# EAGLE design Dandanator CPC MX4 v1.2 Rwd (EAGLE 8.6.0)
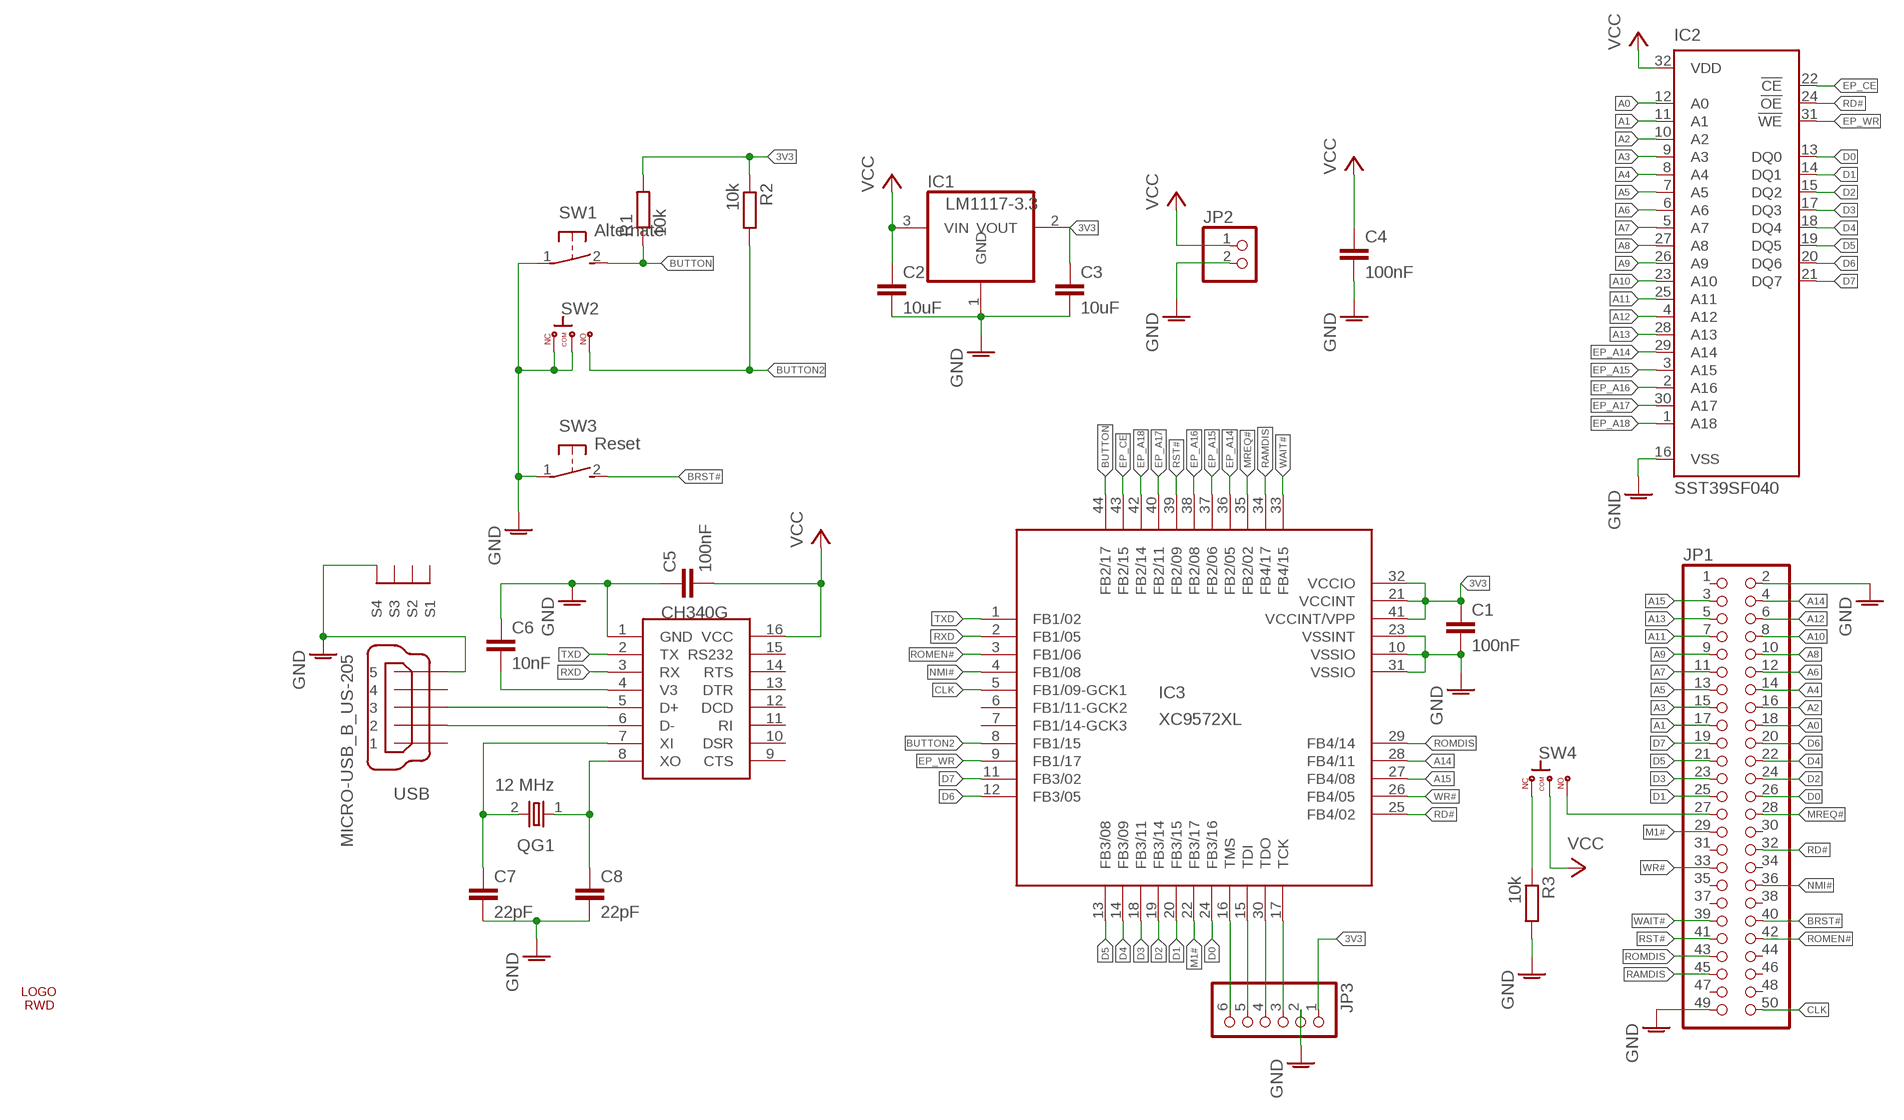
[diagram p0: schematic, sheet 1]

## Parts
C1  100nF  C-EUC0805  [C0805]
C2  10uF  C-EUC0805  [C0805]
C3  10uF  C-EUC0805  [C0805]
C4  100nF  C-EUC0805  [C0805]
C5  100nF  C-EUC0805  [C0805]
C6  10nF  C-EUC0805  [C0805]
C7  22pF  C-EUC0805  [C0805]
C8  22pF  C-EUC0805  [C0805]
CH340G  CH340G  [SOIC16]
IC1  LM1117-3.3  REG1117  [SOT223]
IC2  SST39SF040  MICROCHIP_SST39SF040C  [S32]
IC3  XC9572XL  XC9572XL_44PLCCDIP  [S44]
JP1  PINHD-2X25  [2X25]
JP2  PINHD-1X2  [1X02]
JP3  PINHD-1X6  [1X06]
QG1  12 MHz  CRYSTAL_CRYSTALHC49S  [CRYSTAL_HC49/S]
R1  10k  R-EU_R0805  [R0805]
R2  10k  R-EU_R0805  [R0805]
R3  10k  R-EU_R0805  [R0805]
SW1  Alternate  31-XX  [B3F-31XX]
SW2  Disable  1P2T-MSK12D19  [1P2T-MSK12D19-DIP]
SW3  Reset  31-XX  [B3F-31XX]
SW4  ON/OFF  1P2T-MSK12D19  [1P2T-MSK12D19-DIP]
U$1  LOGO7BOTTOM  [LOGO7_SK22]
USB  MICRO-USB_B_US-205  [MICRO-USB_B_US-205_DIP]

## Nets
3V3: C1.1 C3.1 IC1.2(VOUT) IC3.21(VCCINT) IC3.32(VCCIO) IC3.41(VCCINT/VPP) JP3.1 R1.2 R2.1
A0: IC2.12(A0) JP1.18
A1: IC2.11(A1) JP1.17
A2: IC2.10(A2) JP1.16
A3: IC2.9(A3) JP1.15
A4: IC2.8(A4) JP1.14
A5: IC2.7(A5) JP1.13
A6: IC2.6(A6) JP1.12
A7: IC2.5(A7) JP1.11
A8: IC2.27(A8) JP1.10
A9: IC2.26(A9) JP1.9
A10: IC2.23(A10) JP1.8
A11: IC2.25(A11) JP1.7
A12: IC2.4(A12) JP1.6
A13: IC2.28(A13) JP1.5
A14: IC3.28(FB4/11) JP1.4
A15: IC3.27(FB4/08) JP1.3
AGND: C1.2 C2.2 C3.2 C4.2 C5.1 C6.1 C7.2 C8.2 CH340G.1(GND) IC1.1(GND) IC2.16(VSS) IC3.10(VSSIO) IC3.23(VSSINT) IC3.31(VSSIO) JP1.2 JP1.49 JP2.2 JP3.2 R3.2 SW1.1(P) SW2.P$1 SW2.P$2 SW3.1(P) USB.5 USB.M4(S4) ; supply symbol labelled GND
BRST#: JP1.40 SW3.2(S)
BUTTON: IC3.44(FB2/17) R1.1 SW1.2(S)
BUTTON2: IC3.8(FB1/15) R2.2 SW2.P$3
CLK: IC3.5(FB1/09-GCK1) JP1.50
D0: IC2.13(DQ0) IC3.24(FB3/16) JP1.26
D1: IC2.14(DQ1) IC3.20(FB3/15) JP1.25
D2: IC2.15(DQ2) IC3.19(FB3/14) JP1.24
D3: IC2.17(DQ3) IC3.18(FB3/11) JP1.23
D4: IC2.18(DQ4) IC3.14(FB3/09) JP1.22
D5: IC2.19(DQ5) IC3.13(FB3/08) JP1.21
D6: IC2.20(DQ6) IC3.12(FB3/05) JP1.20
D7: IC2.21(DQ7) IC3.11(FB3/02) JP1.19
EP_A14: IC2.29(A14) IC3.36(FB2/05)
EP_A15: IC2.3(A15) IC3.37(FB2/06)
EP_A16: IC2.2(A16) IC3.38(FB2/08)
EP_A17: IC2.30(A17) IC3.40(FB2/11)
EP_A18: IC2.1(A18) IC3.42(FB2/14)
EP_CE: IC2.22(!CE) IC3.43(FB2/15)
EP_WR: IC2.31(!WE) IC3.9(FB1/17)
M1#: IC3.22(FB3/17) JP1.29
MREQ#: IC3.35(FB2/02) JP1.28
N$1: IC3.16(TMS) JP3.6
N$2: IC3.15(TDI) JP3.5
N$3: IC3.30(TDO) JP3.4
N$4: IC3.17(TCK) JP3.3
N$5: JP1.27 SW4.P$3
N$6: C6.2 CH340G.4(V3)
N$7: CH340G.6(D-) USB.2
N$8: CH340G.5(D+) USB.3
N$9: C8.1 CH340G.8(XO) QG1.1
N$10: C7.1 CH340G.7(XI) QG1.2
N$11: R3.1 SW4.P$1
NMI#: IC3.4(FB1/08) JP1.36
RAMDIS: IC3.34(FB4/17) JP1.45
RD#: IC2.24(!OE) IC3.25(FB4/02) JP1.32
ROMDIS: IC3.29(FB4/14) JP1.43
ROMEN#: IC3.3(FB1/06) JP1.42
RST#: IC3.39(FB2/09) JP1.41
RXD: CH340G.3(RX) IC3.2(FB1/05)
TXD: CH340G.2(TX) IC3.1(FB1/02)
VCC: C2.1 C4.1 C5.2 CH340G.16(VCC) IC1.3(VIN) IC2.32(VDD) JP2.1 SW4.P$2
WAIT#: IC3.33(FB4/15) JP1.39
WR#: IC3.26(FB4/05) JP1.33
Unconnected: CH340G.9(CTS) CH340G.10(DSR) CH340G.11(RI) CH340G.12(DCD) CH340G.13(DTR) CH340G.14(RTS) CH340G.15(RS232) IC3.6(FB1/11-GCK2) IC3.7(FB1/14-GCK3) JP1.1 JP1.30 JP1.31 JP1.34 JP1.35 JP1.37 JP1.38 JP1.44 JP1.46 JP1.47 JP1.48 USB.1 USB.4 USB.M1(S1) USB.M2(S2) USB.M3(S3)

## Library data of the parts
C1-C8 = rcl:C-EU: CAPACITOR, European symbol; SPICEPREFIX: C
CH340G = ch340g:CH340G
IC1 = burr-brown:REG1117: 800mA and 1A Low Dropout (LDO) Positive Regulator 1.8V, 2.5V, 2.85V, 3.3V, 5V, and Adj; MPN: REG1117; OC_FARNELL: 1097566; OC_NEWARK: 14P6981
IC2 = Dandanator CPC MX4 v1.2 Rwd:MICROCHIP_SST39SF040: CMOS EPROM 512 K (64 K x 8)
IC3 = Dandanator CPC MX4 v1.2 Rwd:XC9572XL_44PLCC: xc9536_pc44 XC9500 In-System Programmable CPLD Family Auto generated by make-symbol-device-package-bsdl.ulp Rev. 34 Source: xc9536_pc44.bsd
JP1 = pinhead:PINHD-2X25: PIN HEADER
JP2 = pinhead:PINHD-1X2: PIN HEADER
JP3 = pinhead:PINHD-1X6: PIN HEADER
QG1 = Dandanator CPC Rwd:CRYSTAL_CRYSTAL: CRYSTAL; OC_FARNELL: 1667008; OC_NEWARK: unknown
R1-R3 = rcl:R-EU_: RESISTOR, European symbol; SPICEPREFIX: R
SW1 SW3 = switch-omron:31-XX: OMRON SWITCH; MPN: B3F-3100; OC_FARNELL: 959704; OC_NEWARK: 36M3582
SW2 SW4 = Dandanator CPC MX4 v1.2 Rwd:1P2T-MSK12D19
U$1 = USB_Floppy_PCB_rwd:LOGO7
USB = Dandanator CPC MX4 v1.2 Rwd:MICRO-USB_B_US-205: MINI USB-B R/A W/O POST 5 pol. Source: www.cypressindustries.com

## Board
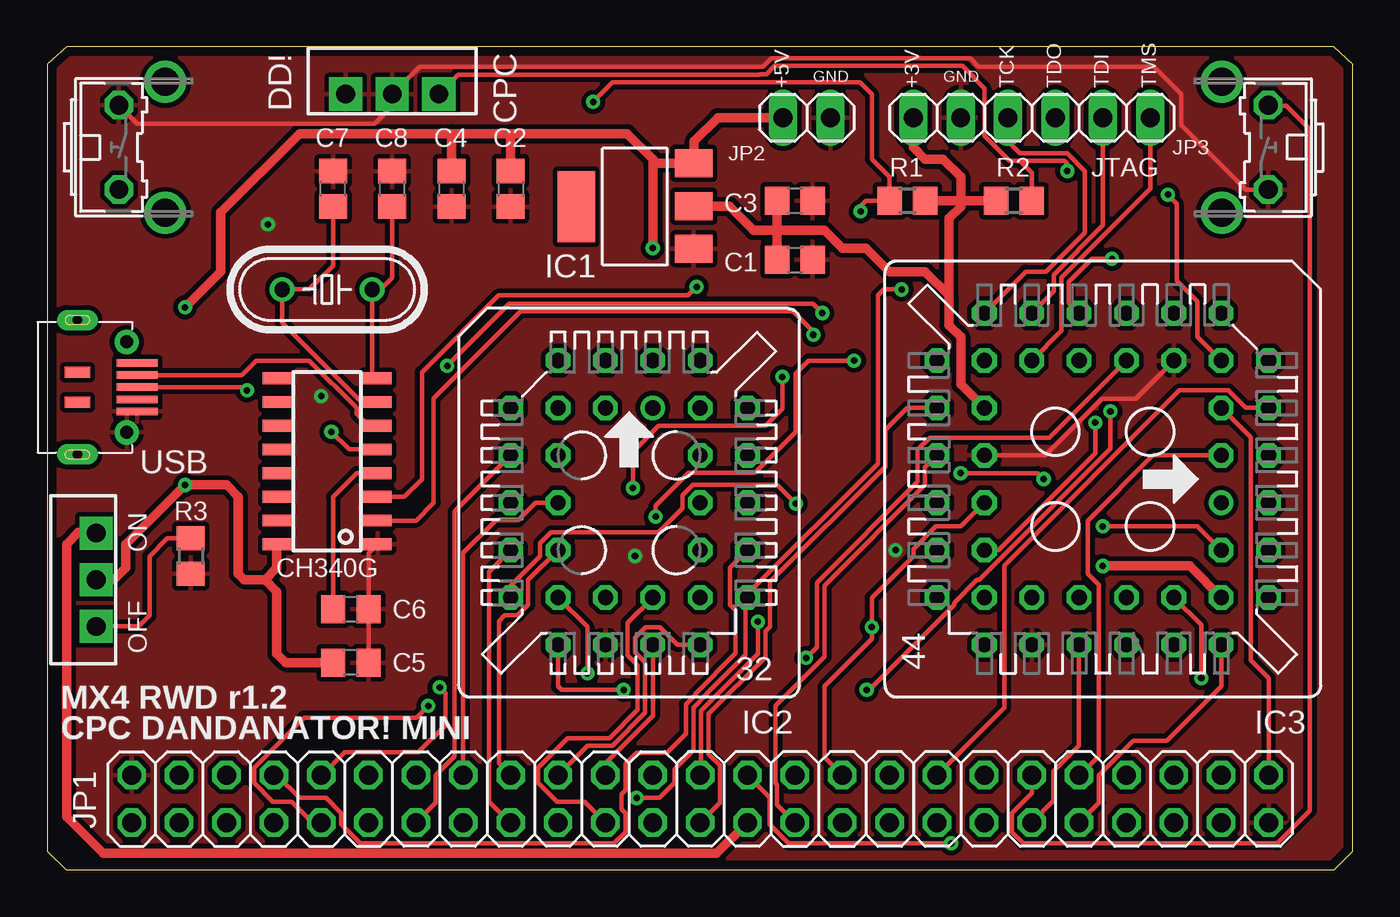
[diagram p1: board, top side]
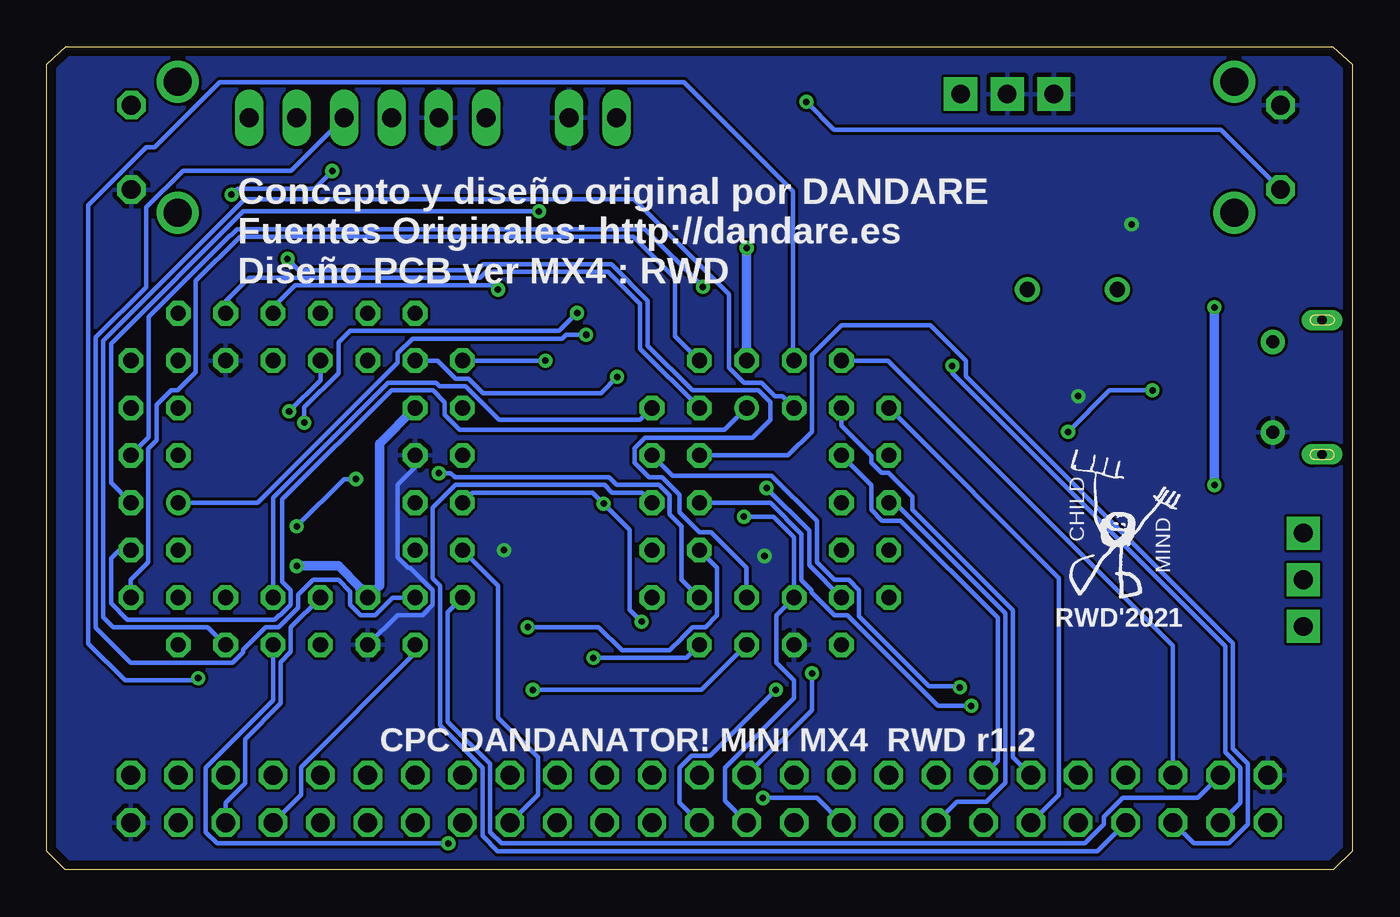
[diagram p2: board, bottom side, seen from below]

Size 70 x 44.13 mm. Coordinates in mm from the lower left corner, seen from the top.
Outline: 68.97,44.13 1.03,44.13 0,43.18 0,1 1,0 69,0 70,1 70,43.18 68.97,44.13
Copper layers (1*16): Top 0.035mm / dielectric 1.5mm / Bottom 0.035mm
Design rules "Rwd *": minimum track width 10mil, minimum drill 0.35mm, track to track 6mil, track to pad 6mil, pad to pad 6mil, via to via 6mil, smd to smd 6mil, copper to edge 0.5mm, drill to drill 8mil, minimum pad ring 10mil, minimum via ring 8mil, stop-mask expansion 4mil, vias tented up to drill 0mil, thermal gap 10mil

### Footprints (pad centres in the part's own frame; a part is rotated, then mirrored left to right if it is on the bottom)
C0805 = smd 1.3 x 1.5: 1 -0.95,0; 2 0.95,0
SOIC16 = smd 0.635 x 1.524: 1 -4.445,-2.695; 2 -3.175,-2.695; 3 -1.905,-2.695; 4 -0.635,-2.695; 5 0.635,-2.695; 6 1.905,-2.695; 7 3.175,-2.695; 8 4.445,-2.695; 9 4.445,2.695; 10 3.175,2.695; 11 1.905,2.695; 12 0.635,2.695; 13 -0.635,2.695; 14 -1.905,2.695; 15 -3.175,2.695; 16 -4.445,2.695
SOT223 = smd 1.499 x 2.007: 1 -2.261,-3.15; 2 0.025,-3.15; 3 2.311,-3.15 | smd 3.81 x 2.007: 4 0,3.15
S32 = drill 0.813: 1 1.27,5.08 | drill 0.813 octagon: 2 -1.27,7.62; 3 -1.27,5.08; 4 -3.81,7.62; 5 -6.35,5.08; 6 -3.81,5.08; 7 -6.35,2.54; 8 -3.81,2.54; 9 -6.35,0; 10 -3.81,0; 11 -6.35,-2.54; 12 -3.81,-2.54; 13 -6.35,-5.08; 14 -3.81,-7.62; 15 -3.81,-5.08; 16 -1.27,-7.62; 17 -1.27,-5.08; 18 1.27,-7.62; 19 1.27,-5.08; 20 3.81,-7.62; 21 6.35,-5.08; 22 3.81,-5.08; 23 6.35,-2.54; 24 3.81,-2.54; 25 6.35,0; 26 3.81,0; 27 6.35,2.54; 28 3.81,2.54; 29 6.35,5.08; 30 3.81,7.62; 31 3.81,5.08; 32 1.27,7.62
S44 = drill 0.813: 1 1.27,6.35 | drill 0.813 octagon: 2 -1.27,8.89; 3 -1.27,6.35; 4 -3.81,8.89; 5 -3.81,6.35; 6 -6.35,8.89; 7 -8.89,6.35; 8 -6.35,6.35; 9 -8.89,3.81; 10 -6.35,3.81; 11 -8.89,1.27; 12 -6.35,1.27; 13 -8.89,-1.27; 14 -6.35,-1.27; 15 -8.89,-3.81; 16 -6.35,-3.81; 17 -8.89,-6.35; 18 -6.35,-8.89; 19 -6.35,-6.35; 20 -3.81,-8.89; 21 -3.81,-6.35; 22 -1.27,-8.89; 23 -1.27,-6.35; 24 1.27,-8.89; 25 1.27,-6.35; 26 3.81,-8.89; 27 3.81,-6.35; 28 6.35,-8.89; 29 8.89,-6.35; 30 6.35,-6.35; 31 8.89,-3.81; 32 6.35,-3.81; 33 8.89,-1.27; 34 6.35,-1.27; 35 8.89,1.27; 36 6.35,1.27; 37 8.89,3.81; 38 6.35,3.81; 39 8.89,6.35; 40 6.35,8.89; 41 6.35,6.35; 42 3.81,8.89; 43 3.81,6.35; 44 1.27,8.89
2X25 = drill 1.016 octagon: 1 -30.48,-1.27; 2 -30.48,1.27; 3 -27.94,-1.27; 4 -27.94,1.27; 5 -25.4,-1.27; 6 -25.4,1.27; 7 -22.86,-1.27; 8 -22.86,1.27; 9 -20.32,-1.27; 10 -20.32,1.27; 11 -17.78,-1.27; 12 -17.78,1.27; 13 -15.24,-1.27; 14 -15.24,1.27; 15 -12.7,-1.27; 16 -12.7,1.27; 17 -10.16,-1.27; 18 -10.16,1.27; 19 -7.62,-1.27; 20 -7.62,1.27; 21 -5.08,-1.27; 22 -5.08,1.27; 23 -2.54,-1.27; 24 -2.54,1.27; 25 0,-1.27; 26 0,1.27; 27 2.54,-1.27; 28 2.54,1.27; 29 5.08,-1.27; 30 5.08,1.27; 31 7.62,-1.27; 32 7.62,1.27; 33 10.16,-1.27; 34 10.16,1.27; 35 12.7,-1.27; 36 12.7,1.27; 37 15.24,-1.27; 38 15.24,1.27; 39 17.78,-1.27; 40 17.78,1.27; 41 20.32,-1.27; 42 20.32,1.27; 43 22.86,-1.27; 44 22.86,1.27; 45 25.4,-1.27; 46 25.4,1.27; 47 27.94,-1.27; 48 27.94,1.27; 49 30.48,-1.27; 50 30.48,1.27
1X02 = drill 1.016 long: 1 -1.27,0; 2 1.27,0
1X06 = drill 1.016 long: 1 -6.35,0; 2 -3.81,0; 3 -1.27,0; 4 1.27,0; 5 3.81,0; 6 6.35,0
CRYSTAL_HC49/S = drill 0.813: 1 -2.413,0; 2 2.413,0
R0805 = smd 1.3 x 1.5: 1 -0.95,0; 2 0.95,0
B3F-31XX = drill 1.016 octagon: 1 -2.261,-1.245; 2 2.261,-1.245 | drill 1.499 pad 2.159: 3 -3.505,1.245; 4 3.505,1.245
1P2T-MSK12D19-DIP = drill 1 pad 1.778 square: P$1 -2.5,0; P$2 0,0; P$3 2.5,0
MICRO-USB_B_US-205_DIP = smd 2.2 x 0.4: 1 4.95,1.3; 2 4.95,0.65; 3 4.95,0; 4 4.95,-0.65; 5 4.95,-1.3 | smd 1.35 x 0.6: 6 1.75,0.8; 7 1.75,-0.8 | drill 0.5 pad 1.1 long: M1 1.75,3.6; M2 1.75,-3.6 | drill 0.7 pad 1.3: M3 4.4,2.425; M4 4.4,-2.425

### Placement (x,y rotation side)
C1  40.08,32.7 0 top
C2  24.84,36.51 270 top
C3  40.08,35.88 0 top
C4  21.66,36.51 270 top
C5  16.27,11.11 180 top
C6  16.27,13.97 180 top
C7  15.32,36.51 90 top
C8  18.49,36.51 90 top
CH340G  15,21.91 90 top
IC1  31.51,35.56 90 top
IC2  31.19,19.68 0 top
IC3  56.59,20.95 270 top
JP1  35,3.81 0 top
JP2  40.72,40.32 0 top
JP3  52.78,40.32 0 top
QG1  15,31.11 180 top
R1  46.11,35.88 0 top
R2  51.83,35.88 0 top
R3  7.7,16.83 270 top
SW1  5.08,38.73 270 top
SW2  18.49,41.59 0 top
SW3  64.21,38.73 90 top
SW4  2.62,15.56 90 top
U$1  8.65,14.29 0 top
USB  -0.14,25.88 0 top

### Tracks (layer width: path | path; a pad name or v marks a point on that pad's centre or on a via)
3V3  (via drill 0.35)
  Top 0.508: C3.1 39.13,34.29 | 39.13,34.29 C1.1 | IC3.21 48.97,26.04 48.97,28.57 48.34,29.21 48.34,30.8 | v56.59,16.29 61.25,16.29 IC3.41 | 39.13,34.29 37.86,34.29 36.56,35.59 IC1.2 | R1.2 48.97,35.88 | 48.97,35.88 48.97,37.15 48.02,38.1 47.06,38.1 46.43,38.73 JP3.1 | 48.34,30.8 48.34,34.92 48.97,35.56 48.97,35.88 | 48.34,30.8 47.06,32.07 45.16,32.07 43.89,33.34 42.62,33.34 41.67,34.29 39.13,34.29 | 48.97,35.88 R2.1
  Bottom 0.508: IC3.21 52.15,22.86 52.15,15.24 IC3.32 53.19,15.01 53.19,15.13 54.35,16.29 v56.59,16.29
A0
  Top 0.254: IC2.12 25.78,15.54 25.78,14.22 25.22,13.65 24.52,13.65 24.21,13.34 24.21,5.71 JP1.18
A1
  Top 0.254: IC2.11 23.67,15.98 23.67,3.66 24.79,2.54 JP1.17
A2
  Top 0.254: IC2.10 26.17,19.68 25.23,18.75 24.05,18.75 22.3,16.99 JP1.16
A3
  Bottom 0.254: IC2.9 24.52,19.68 18.59,13.75 18.59,4.67 19.61,3.66 21.18,3.66 JP1.15
A4
  Bottom 0.254: JP1.14 19,5.84 19,13.53 24.21,18.73 25.22,18.73 25.78,19.3 25.78,20.62 IC2.8
A5
  Top 0.254: IC2.7 21.84,19.23 21.84,6.1 20.83,5.08 20.83,3.61 JP1.13
A6
  Bottom 0.254: IC2.6 27.38,23.81 25.78,22.21 25.78,21.84 25.23,21.29 24.85,21.29 23.57,20 23.57,19.31 18.19,13.92 18.19,6.04 JP1.12
A7
  Bottom 0.254: JP1.11 15.72,4.04 15.72,15.65 IC2.5
A8  (via drill 0.35)
  Top 0.254: JP1.10 14.73,5.08 15.95,6.3 19.89,6.3 21.35,7.76 21.35,9.47 v21.03,9.79
  Bottom 0.254: IC2.27 36.45,21.13 31.12,21.13 28.7,18.71 28.7,16.5 27.75,15.54 26.99,15.54 26.44,14.99 26.44,13.61 22.68,9.84 21.08,9.84 v21.03,9.79
A9  (via drill 0.35)
  Top 0.254: JP1.9 14.22,2.54 13.11,3.66 12.09,3.66 11.07,4.67 11.07,5.49 13.75,8.17 19.79,8.17 v20.42,8.8
  Bottom 0.254: IC2.26 31.2,19.68 29.51,18 29.51,15.53 28.98,14.99 28.98,14.88 27.76,13.65 27.06,13.65 22.21,8.8 v20.42,8.8
A10
  Top 0.254: JP1.8 12.29,5.08 13.51,3.86 14.93,3.86 15.75,3.05 15.75,2.44 16.76,1.42 30.38,1.42 30.99,2.03 30.99,3.05 30.78,3.25 30.78,4.06 30.99,4.27 30.99,5.69 31.58,6.28 33.22,6.28 34.24,7.3 34.24,8.87 34.75,9.38 34.75,9.46 36.91,11.61 36.91,13.91 36.6,14.22 36.6,16.2 IC2.23
A11
  Bottom 0.254: IC2.25 38.09,20.23 39.67,20.23 40.08,20.64 48.08,20.64 49.3,19.41 49.3,15.65 48.89,15.24 48.89,7.75 46.63,5.49 46.63,1.83 45.82,1.02 13.66,1.02 JP1.7
A12
  Bottom 0.254: IC2.4 24.89,27.3 9.6,12.01 JP1.6
A13
  Bottom 0.254: IC2.28 30.24,22.23 28.97,23.5 28.97,27.62 27.38,29.21 22.62,29.21 20.71,27.3 20.71,26.47 6.4,12.16 6.4,6.5 5.59,5.69 5.59,2.44 6.6,1.42 8.48,1.42 JP1.5
A14
  Bottom 0.254: IC3.28 48.49,13.82 48.49,7.95 46.23,5.69 46.23,2.03 45.62,1.42 14.32,1.42 13.31,2.44 13.31,2.85 12.29,3.86 8.28,3.86 JP1.4
A15  (via drill 0.35)
  Top 0.254: v21.44,27.03 24.76,30.35 41.06,30.35 v41.55,29.86 | v56.18,23.98 56.18,22.33 50.99,17.14 IC3.27
  Bottom 0.254: v56.18,23.98 56.18,24.79 54.34,26.64 54.34,28.29 53.73,28.89 42.52,28.89 v41.55,29.86 | v21.44,27.03 21.44,26.62 6.81,11.99 6.81,6.3 5.99,5.49 5.99,3.61 JP1.3
AGND  (via drill 0.35)
  Top 0.254: IC3.10 58.36,25.26 56.54,25.26 53.5,22.23 IC3.23 | SW3.1 64.25,36.47 60.81,39.92 60.81,41.59 59.33,43.07 49.92,43.07 49.48,43.51 38.82,43.51 38.38,43.07 19.96,43.07 SW2.P$2 18.49,40.96 17.54,40.01 4.83,40.01 SW1.1 | C5.1 C6.1 | C6.1 17.22,12.96 | 17.54,17.46 CH340G.1 17.22,16.99 C6.1
  Bottom 0.254: IC3.31 51.18,13.66 49.85,13.66 49.3,14.22 49.3,14.99 50.51,16.2 50.63,16.2 51.19,16.77 51.19,20.64 50.24,21.59 IC3.23
  other vias: 11.82,34.61 14.68,25.4 31.51,16.83 45.48,17.14
  pour Top (isolate 0.254): 0.07,0 69.92,0 69.92,44.13 0.07,44.13
  pour Bottom (isolate 0.025): 0.07,44.13 0.07,0 69.92,0 69.92,44.13
BRST#
  Top 0.254: SW3.2 65.49,40.96 66.43,40.96 67.7,39.69 67.7,3.18 65.94,1.42 52.32,1.42 51.71,2.03 51.71,3.05 52.78,4.12 JP1.40
BUTTON  (via drill 0.35)
  Top 0.254: v29.26,41.17 30.31,42.23 43.57,42.23 44.21,41.59 44.21,38.1 45.16,37.15 R1.1 43.89,35.88 43.6,35.59 v43.6,35.31
  Bottom 0.254: IC3.44 66.55,20.75 66.55,28.21 59.45,35.31 v43.6,35.31 | v29.26,41.17 27.77,39.69 7.05,39.69 SW1.2
BUTTON2  (via drill 0.35)
  Top 0.254: IC3.8 61.67,28.57 61.67,30.48 60.56,31.59 60.56,35.72 v60.08,36.2 | v54.69,37.47 54.69,37.84 54.52,38.01 52.15,38.01 | 52.15,38.01 51.59,38.01 50.24,39.36 50.24,41.91 49.05,43.1 38.99,43.1 38.55,42.66 38.2,42.66 38.18,42.63 22.03,42.63 SW2.P$3 | 52.15,38.01 52.78,37.38 R2.2 arc-45 R2.2
  Bottom 0.254: v60.08,36.2 59.77,36.51 55.64,36.51 v54.69,37.47
CLK
  Top 0.254: JP1.50 65.48,10.29 64.52,11.25 64.52,23.19 IC3.5
D0  (via drill 0.35)
  Top 0.254: v38.1,13.31 38.1,11.58 35.05,8.53 35.05,5.08 JP1.26 | v40.13,19.63 39.13,20.64 34.62,20.64 34.06,20.07 34.06,19.38 32.78,18.1 27,18.1 26.43,17.52 26.43,16.83 24.84,15.24 IC2.13 | IC2.13
  Bottom 0.254: v38.1,13.31 38.73,13.95 38.73,18.24 v40.13,19.63 40.73,20.23 47.15,20.23 IC3.24
D1  (via drill 0.35)
  Top 0.254: v30.9,9.65 27.57,9.65 27.38,9.84 IC2.14 | JP1.25 36.07,3.61 36.07,5.6 35.46,6.21 35.46,8.37 38.51,11.41 38.51,12.79 38.76,13.04 38.76,15.44 44.93,21.62 44.93,23.58 46.11,24.77 IC3.20
  Bottom 0.254: v30.9,9.65 34.43,6.12 35.43,6.12 36.07,5.49 36.07,3.61 JP1.25
D2  (via drill 0.35)
  Top 0.254: v39.41,26.43 39.41,24.73 38.49,23.81 32.78,23.81 31.39,22.43 v31.39,20.47 | v28.96,10.54 28.96,13.03 IC2.15
  Bottom 0.254: v28.96,10.54 28.96,8.57 28.97,8.57 JP1.24 | IC2.15 29.11,16.33 29.11,18.19 v31.39,20.47 | IC3.19 49.03,27.3 48.06,26.34 47.37,26.34 46.59,25.56 40.28,25.56 v39.41,26.43
D3  (via drill 0.35)
  Top 0.254: v43.26,27.3 40.82,27.3 40.11,26.6 40.11,23.46 37.93,21.29 34.38,21.29 32.61,19.52 v32.61,18.94
  Bottom 0.254: v43.26,27.3 IC3.18 | v32.61,18.94 31.03,18.94 29.92,17.83 IC2.17 30.87,13.65 30.87,11.11 29.92,10.16 29.92,9.2 33.63,5.49 33.63,3.71 JP1.23
D4  (via drill 0.35)
  Top 0.254: IC2.18 32.46,8.26 29.92,5.71 JP1.22 | v57,24.59 57,22.57 49.97,15.54 49.85,15.54 48.64,14.33 48.64,14.22 44.08,9.65 v43.93,9.65
  Bottom 0.254: IC3.14 55.32,26.26 v57,24.59 | v43.93,9.65 34.87,9.65 IC2.18
D5  (via drill 0.35)
  Top 0.254: IC2.19 31.11,13.26 31.11,11.51 31.51,11.11 31.65,10.97 31.65,8.59 30.13,7.07 27.9,7.07 26.31,5.49 26.31,4.67 27.33,3.66 28.8,3.66 JP1.21 | IC3.13 54.77,30.39 54.77,31.52 56.01,32.75 v57.09,32.75
  Bottom 0.254: IC2.19 32.46,16.19 34.37,18.1 35,18.1 36.07,19.16 36.07,20.12 36.99,21.04 37.69,21.04 38.48,21.84 38.48,22.61 37.92,23.18 32.14,23.18 31.19,24.13 31.19,25.08 31.82,25.72 34.68,25.72 34.7,25.7 35.37,25.7 37.77,28.11 37.77,30.52 39.72,32.47 46.6,32.47 46.92,32.16 56.49,32.16 v57.09,32.75
D6  (via drill 0.35)
  Top 0.254: IC2.20 33.79,12.06 32.85,13.01 32.07,13.01 31.52,12.45 31.52,11.68 32.05,11.14 32.05,8.42 30.3,6.67 28.97,6.67 JP1.20 | IC3.12 53.72,23.16 47.31,23.16 46.66,22.51 46.66,20.81 41.26,15.41 41.26,11.95 v40.68,11.37
  Bottom 0.254: IC2.20 35.7,11.37 v40.68,11.37
D7  (via drill 0.35)
  Top 0.254: v31.6,3.86 32.82,3.86 33.63,4.67 33.63,5.4 34.64,6.41 34.64,8.7 35.38,9.43 35.38,9.47 37.44,11.53 37.44,14.5 IC2.21 37.54,14.8 44.52,21.79 44.52,30.8 44.84,31.11 v45.8,31.11
  Bottom 0.254: IC3.11 57.86,30.16 56.68,31.34 46.02,31.34 v45.8,31.11 | JP1.19 28.7,3.86 v31.6,3.86
EP_A14
  Bottom 0.254: IC2.29 38.18,24.13 45.74,24.13 47.54,25.93 48.93,25.93 49.12,26.12 51.68,26.12 57.86,19.94 IC3.36
EP_A15
  Bottom 0.254: IC2.3 30.55,25.4 30.93,25.4 31.66,26.12 32.61,26.12 33.4,26.92 33.4,30.86 38.5,35.96 59.37,35.96 66.95,28.38 66.95,13.54 66.43,13.02 61.35,13.02 IC3.37
EP_A16  (via drill 0.35)
  Top 0.254: v61.87,10.29 61.87,13.13 IC3.38
  Bottom 0.254: IC2.2 29.97,27.36 29.97,36.37 35.83,42.23 60.72,42.23 64.21,38.73 64.67,38.73 67.77,35.64 67.77,12.13 65.8,10.16 62,10.16 v61.87,10.29
EP_A17
  Bottom 0.254: 38.2,33.63 36.3,31.73 36.3,31.11 | 38.2,33.63 38.52,33.95 59.62,33.95 62,31.57 62,26.67 62.97,25.7 63.33,25.7 64.11,24.93 64.11,23.02 64.54,22.59 64.54,16.5 65.48,15.56 IC3.40 | 36.3,31.11 36.3,28.6 IC2.30 | 36.3,31.11 | 38.2,33.63
EP_A18
  Bottom 0.254: IC2.1 33.64,23.58 42.76,23.58 42.77,23.6 47.86,23.6 48.65,24.39 48.65,25.08 49.29,25.72 51.51,25.72 57.37,19.86 57.37,15.44 56.92,14.99 56.92,14.22 57.47,13.66 57.53,13.66 57.77,13.42 65.68,13.42 66.55,14.29 66.55,16.71 66.11,17.14 IC3.42
EP_CE  (via drill 0.35)
  Top 0.254: v56.59,18.41 61.67,18.41 IC3.43 | v48.97,21.27 53.1,21.27 v53.41,20.95
  Bottom 0.254: v53.41,20.95 54.05,20.95 v56.59,18.41 | v48.97,21.27 48.34,21.27 48.11,21.04 39.85,21.04 39.45,20.64 37.16,20.64 36.6,20.07 36.6,19.06 35.95,18.41 35.95,15.56 IC2.22
EP_WR
  Bottom 0.254: IC2.31 38.18,27.94 38.18,30.35 39.89,32.07 46.43,32.07 46.75,31.75 59.13,31.75 60.4,30.48 IC3.9
M1#
  Top 0.254: JP1.29 39.13,3.49 39.13,4.56 39.04,4.65 39.04,8.8 41.67,11.43 41.67,15.24 47.06,20.64 47.06,21.59 IC3.22
MREQ#  (via drill 0.35)
  Top 0.254: v48.46,1.42 39.72,1.42 38.71,2.44 38.71,3.91 JP1.28
  Bottom 0.254: v48.46,1.42 60.86,1.42 61.47,2.03 61.47,5.49 57.86,9.09 IC3.35
N$1
  Top 0.254: JP3.6 59.13,39.69 59.13,39.05 59.13,36.51 54.37,31.75 54.37,28.89 IC3.16
N$2
  Top 0.254: IC3.15 53.96,31.03 53.96,31.92 56.59,34.55 JP3.5
N$3
  Bottom 0.254: IC3.30 51.45,14.61 52.39,13.66 53.17,13.66 53.72,14.22 53.72,14.91 54.36,15.54 55.71,15.54 56.51,14.74 56.51,14.05 56.59,13.97 57.55,13.01 58.25,13.01 59.46,11.79 59.46,11.68 60.02,11.11 65.48,11.11 67.36,12.99 67.36,28.55 64.66,31.25 64.66,35.52 62.69,37.49 57.23,37.49 56.93,37.49 56.88,37.49 JP3.4
N$4
  Top 0.254: JP3.3 51.51,39.05 52.15,38.42 54.69,38.42 55.64,37.47 55.64,34.17 53.54,32.07 52.46,32.07 IC3.17
N$5
  Top 0.508: JP1.27 35.89,0.89 3,0.89 1.03,2.86 1.03,17.46 1.66,18.1 1.7,18.06 SW4.P$3
N$6
  Top 0.254: CH340G.4 16.59,21.27 15.32,20 C6.2
N$7
  Top 0.254: CH340G.6 17.22,23.81 16.59,24.45 16.59,24.77 14.05,27.3 11.19,27.3 10.41,26.53 USB.2
N$8  (via drill 0.35)
  Top 0.254: v15.23,23.48 16.17,22.54 CH340G.5 | v10.7,25.7 10.53,25.88 USB.3
  Bottom 0.254: v15.23,23.48 13,25.7 v10.7,25.7
N$9
  Top 0.254: C8.1 18.49,31.75 17.86,31.11 QG1.1 17.41,26.63 CH340G.8
N$10
  Top 0.254: C7.1 15.32,32.38 14.05,31.11 QG1.2 12.58,29.34 16.84,25.08 CH340G.7
N$11
  Top 0.254: R3.1 6.42,17.78 5.47,16.83 5.47,13.65 4.84,13.02 4.8,13.06 SW4.P$1
NMI#
  Top 0.254: IC3.4 64.27,24.77 63.33,25.7 60.7,25.7 51.31,16.31 51.31,8.69 JP1.36
RAMDIS
  Bottom 0.254: JP1.45 60.4,3.61 59.36,4.65 59.36,7.02 57.45,8.93 57.45,11.14 56.91,11.69 56.91,13.02 IC3.34
RD#  (via drill 0.35)
  Top 0.254: IC3.25 48.97,18.41 47.64,18.41 46.43,17.2 46.43,16.83 44.21,14.61 v44.21,13.02 44.21,12.38 41.67,9.84 41.67,6.03 JP1.32
  Bottom 0.254: IC2.24 34.05,16.19 34.05,13.65 34.68,13.02 35.38,13.02 35.94,12.45 35.94,12.42 36.59,11.77 39.15,11.77 40.4,13.02 v44.21,13.02
ROMDIS
  Bottom 0.254: IC3.29 50.24,11.63 56.36,5.51 56.36,4.04 JP1.43
ROMEN#
  Top 0.254: JP1.42 55.37,5.08 56.39,6.1 56.39,15.28 55.78,15.89 55.78,18.73 59.27,22.23 IC3.3
RST#
  Top 0.254: IC3.39 62.94,9.84 60.02,6.93 58.23,6.93 56.39,5.08 56.39,3.61 JP1.41
RXD  (via drill 0.35)
  Top 0.254: v34.81,31.25 34.36,30.8 24.2,30.8 20.08,26.68 20.08,20.95 19.12,20 CH340G.3
  Bottom 0.254: IC3.2 64.52,23.19 64.52,29.67 60.15,34.04 60.11,34.04 59.79,34.35 37.91,34.35 v34.81,31.25
TXD  (via drill 0.35)
  Top 0.254: CH340G.2 19.76,18.73 20.71,19.68 20.71,25.29 25.37,29.95 39.98,29.95 41.07,28.85 v41.07,28.69
  Bottom 0.254: IC3.1 58.69,19.68 51.18,27.2 51.18,27.69 50.39,28.49 42.35,28.49 42.15,28.69 v41.07,28.69
VCC  (via drill 0.35)
  Top 0.508: 32.46,37.78 v32.46,33.34 | 32.46,37.78 32.55,37.87 IC1.3 34.68,37.9 34.68,39.05 35.95,40.32 JP2.1 | 32.46,37.78 32.46,38.1 31.09,39.47 24.84,39.47 | 21.66,39.47 13.51,39.47 9.28,35.24 9.28,32.07 v7.38,30.16 | 21.66,39.47 24.84,39.47 | 24.84,39.47 C2.1 | 11.67,15.56 12.3,16.19 CH340G.16 | 11.67,15.56 12.3,14.92 12.3,11.59 12.77,11.11 C5.2 | 11.67,15.56 10.55,15.56 10.23,15.88 10.23,20 9.6,20.64 v7.38,20.64 4.2,17.46 4.2,16.19 3.57,15.56 SW4.P$2 | C4.1 21.66,39.47
  Bottom 0.508: IC2.32 v32.46,33.34 | v7.38,20.64 v7.38,30.16
WAIT#
  Top 0.254: IC3.33 55.32,6.66 53.95,5.28 53.95,3.71 JP1.39
WR#
  Bottom 0.254: JP1.33 43.66,4.04 43.66,6.03 45.8,8.17 45.8,15.24 IC3.26

### Text on the board
bPlace: RWD'2021
tNames: DD! | CPC | +5V | GND | +3V | GND | TCK | TDO | TDI | TMS | JTAG | ON | OFF | MX4 RWD r1.2 / CPC DANDANATOR! MINI
bNames: Concepto y diseño original por DANDARE / Fuentes Originales: http://dandare.es / Diseño PCB ver MX4 : RWD | CPC DANDANATOR! MINI MX4 RWD r1.2
tValues: 12 MHz